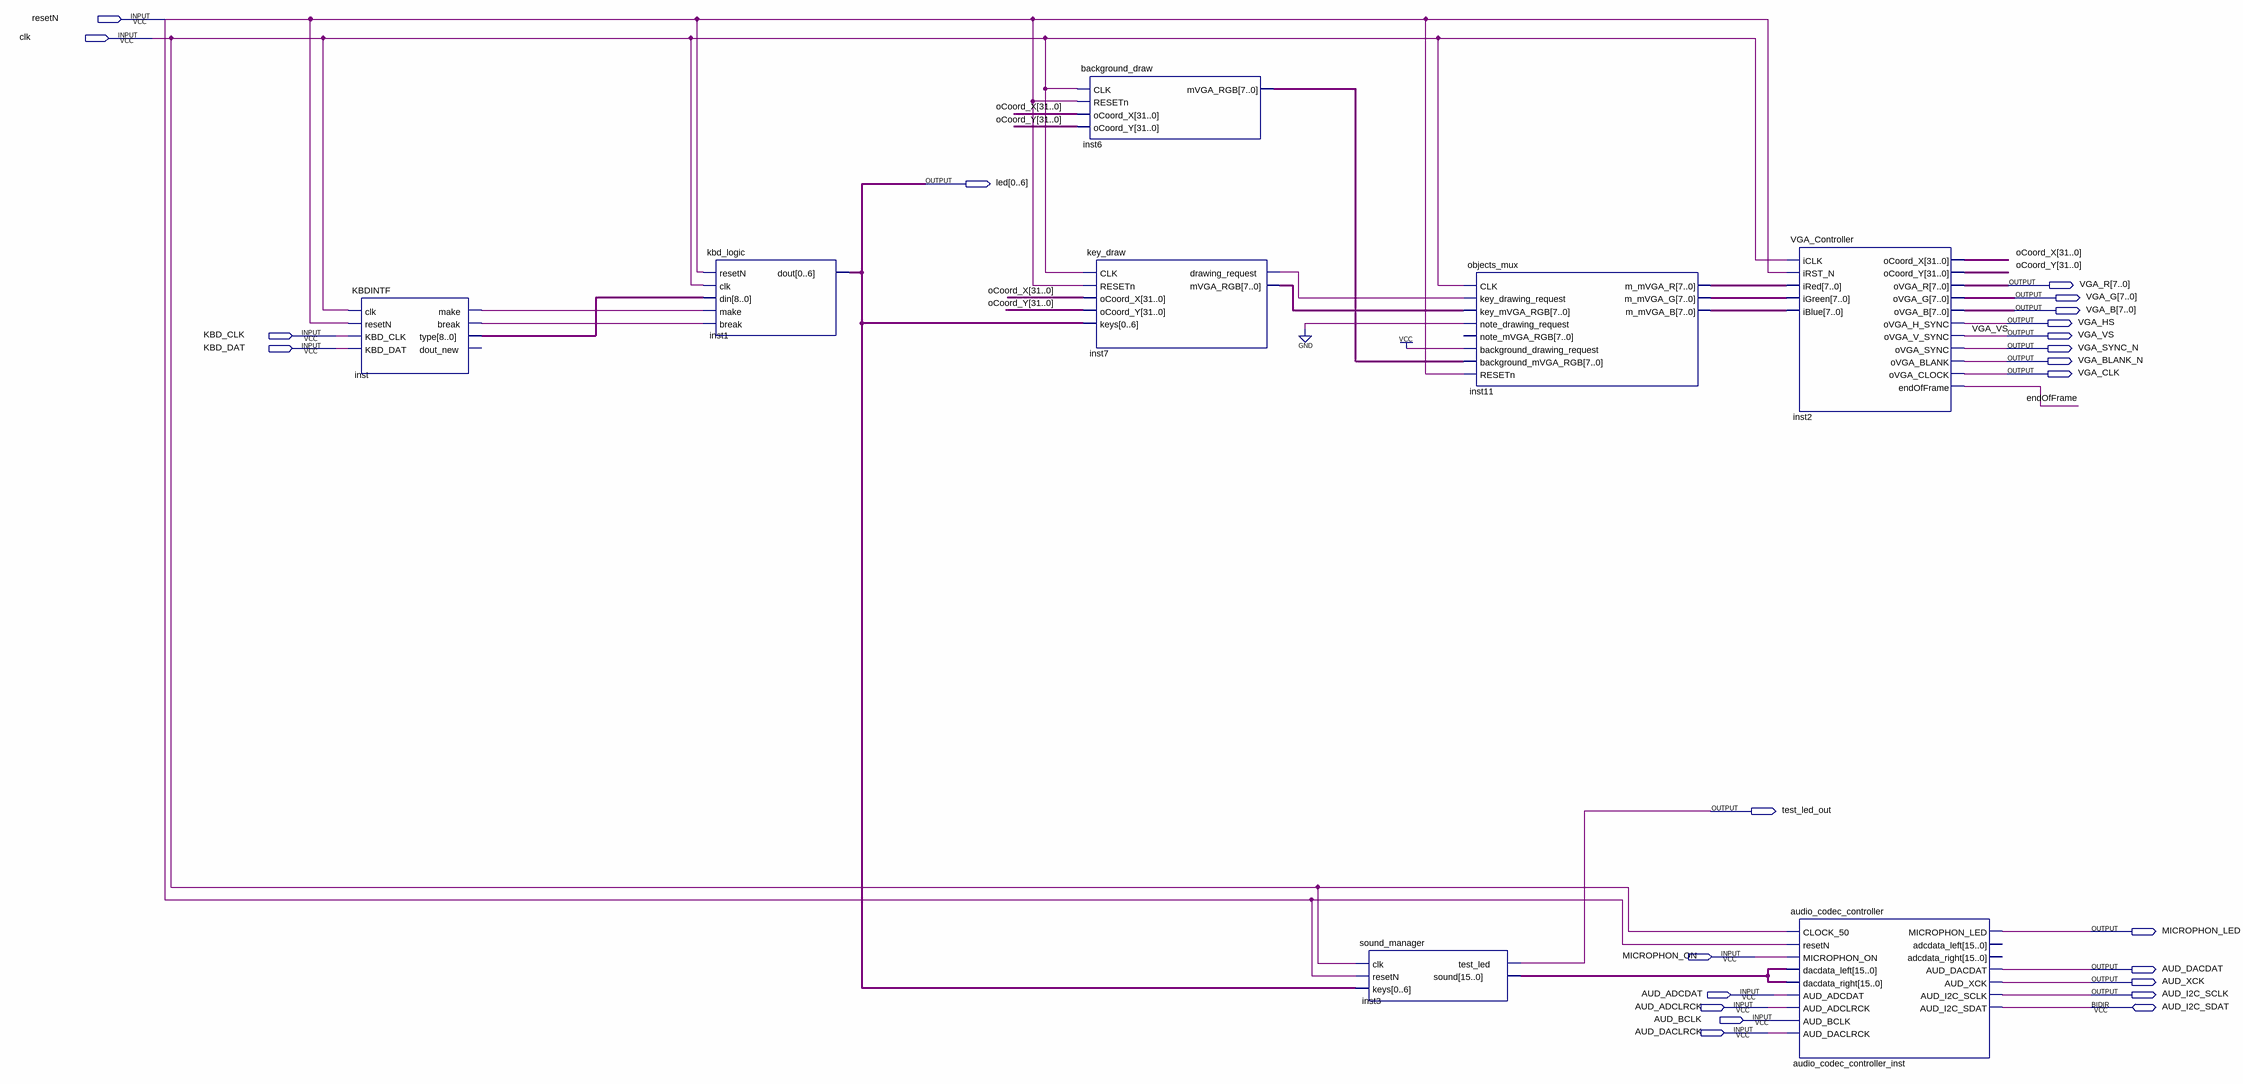
[diagram p0: schematic sheet]
// Quartus schematic top.bdf as structural Verilog: 8 symbols, 24 pins
module top (
  input  resetN,
  input  clk,
  input  KBD_CLK,
  input  KBD_DAT,
  input  MICROPHON_ON,
  input  AUD_ADCDAT,
  input  AUD_ADCLRCK,
  input  AUD_BCLK,
  input  AUD_DACLRCK,
  inout  AUD_I2C_SDAT,
  output [0:6] led,
  output [7:0] VGA_R,
  output [7:0] VGA_G,
  output [7:0] VGA_B,
  output VGA_HS,
  output VGA_VS,
  output VGA_SYNC_N,
  output VGA_BLANK_N,
  output VGA_CLK,
  output test_led_out,
  output MICROPHON_LED,
  output AUD_DACDAT,
  output AUD_XCK,
  output AUD_I2C_SCLK
);

  wire endOfFrame, inst7_drawing_request, inst_break, inst_make;
  wire [7:0] inst6_mvga_rgb, inst7_mvga_rgb, inst11_m_mvga_b, inst11_m_mvga_g, inst11_m_mvga_r;
  wire [8:0] inst_type;
  wire [15:0] inst3_sound;
  wire [31:0] oCoord_X, oCoord_Y;

  KBDINTF inst (
    .clk(clk), .resetN(resetN), .KBD_CLK(KBD_CLK), .KBD_DAT(KBD_DAT), .make(inst_make), .\break (inst_break),
    .\type (inst_type));  // open: dout_new
  kbd_logic inst1 (.resetN(resetN), .clk(clk), .din(inst_type), .make(inst_make), .\break (inst_break), .dout(led));
  background_draw inst6 (
    .CLK(clk), .RESETn(resetN), .oCoord_X(oCoord_X), .oCoord_Y(oCoord_Y), .mVGA_RGB(inst6_mvga_rgb));
  key_draw inst7 (
    .CLK(clk), .RESETn(resetN), .oCoord_X(oCoord_X), .oCoord_Y(oCoord_Y), .keys(led),
    .drawing_request(inst7_drawing_request), .mVGA_RGB(inst7_mvga_rgb));
  sound_manager inst3 (.clk(clk), .resetN(resetN), .keys(led), .test_led(test_led_out), .sound(inst3_sound));
  objects_mux inst11 (
    .CLK(clk), .key_drawing_request(inst7_drawing_request), .key_mVGA_RGB(inst7_mvga_rgb),
    .note_drawing_request(1'b0), .background_drawing_request(1'b1), .background_mVGA_RGB(inst6_mvga_rgb),
    .RESETn(resetN), .m_mVGA_R(inst11_m_mvga_r), .m_mVGA_G(inst11_m_mvga_g), .m_mVGA_B(inst11_m_mvga_b));  // open: note_mVGA_RGB
  VGA_Controller inst2 (
    .iCLK(clk), .iRST_N(resetN), .iRed(inst11_m_mvga_r), .iGreen(inst11_m_mvga_g), .iBlue(inst11_m_mvga_b),
    .oCoord_X(oCoord_X), .oCoord_Y(oCoord_Y), .oVGA_R(VGA_R), .oVGA_G(VGA_G), .oVGA_B(VGA_B),
    .oVGA_H_SYNC(VGA_HS), .oVGA_V_SYNC(VGA_VS), .oVGA_SYNC(VGA_SYNC_N), .oVGA_BLANK(VGA_BLANK_N),
    .oVGA_CLOCK(VGA_CLK), .endOfFrame(endOfFrame));
  audio_codec_controller audio_codec_controller_inst (
    .CLOCK_50(clk), .resetN(resetN), .MICROPHON_ON(MICROPHON_ON), .dacdata_left(inst3_sound),
    .dacdata_right(inst3_sound), .AUD_ADCDAT(AUD_ADCDAT), .AUD_ADCLRCK(AUD_ADCLRCK), .AUD_BCLK(AUD_BCLK),
    .AUD_DACLRCK(AUD_DACLRCK), .MICROPHON_LED(MICROPHON_LED), .AUD_DACDAT(AUD_DACDAT), .AUD_XCK(AUD_XCK),
    .AUD_I2C_SCLK(AUD_I2C_SCLK), .AUD_I2C_SDAT(AUD_I2C_SDAT));  // open: adcdata_left, adcdata_right
endmodule
